# Altium schematic sheet LEDS_Demo.SchDoc
size A4
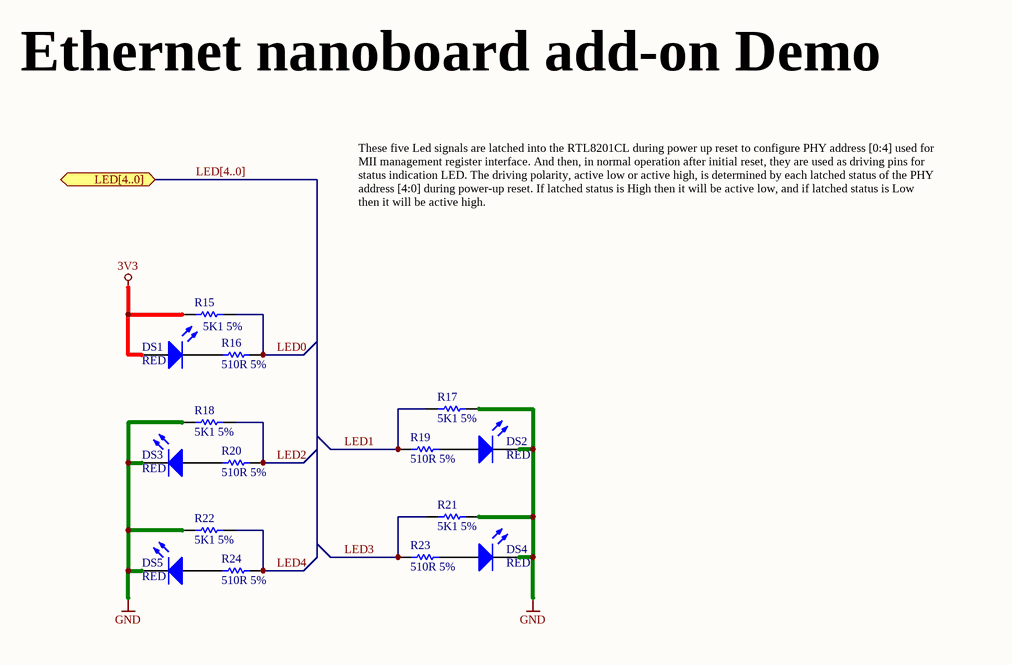
[diagram p0: LEDS_Demo.SchDoc]

## Parts
DS1  RED  [LED2013]
DS2  RED  [LED2013]
DS3  RED  [LED2013]
DS4  RED  [LED2013]
DS5  RED  [LED2013]
R15  5K1 5%  [RESC2012]
R16  510R 5%  [RESC2012]
R17  5K1 5%  [RESC2012]
R18  5K1 5%  [RESC2012]
R19  510R 5%  [RESC2012]
R20  510R 5%  [RESC2012]
R21  5K1 5%  [RESC2012]
R22  5K1 5%  [RESC2012]
R23  510R 5%  [RESC2012]
R24  510R 5%  [RESC2012]

## Ports
LED[4..0] (bidir)

## Nets
3V3: DS1.1(A) R15.2
GND: DS2.2(K) DS3.2(K) DS4.2(K) DS5.2(K) R17.1 R18.2 R21.1 R22.2
LED0: R15.1 R16.1
LED1: R17.2 R19.1
LED2: R18.1 R20.1
LED3: R21.2 R23.1
LED4: R22.1 R24.1
NetDS1_2: DS1.2(K) R16.2
NetDS2_1: DS2.1(A) R19.2
NetDS3_1: DS3.1(A) R20.2
NetDS4_1: DS4.1(A) R23.2
NetDS5_1: DS5.1(A) R24.2

## Buses and harness runs
bus LED[4..0] = port LED[4..0]

## Notes on the sheet
- Ethernet nanoboard add-on Demo
- These five Led signals are latched into the RTL8201CL during power up reset to configure PHY address [0:4] used for MII management register interface. And then, in normal operation after initial reset, they are used as driving pins for status indication LED. The driving polarity, active low or active high, is determined by each latched status of the PHY address [4:0] during power-up reset. If latched status is High then it will be active low, and if latched status is Low then it will be active high.
- Title
- Size:
- Date:
- A4
- Number:
- Time:
- Revision:
- Sheet
- of
- File:

## Library data of the parts
DS1-DS5 = DIO-LED-1S: Typical GREEN SMD LED Agilent make; Design Item Id: LED-RED-HSMHC170
R15-R24 = RES: Resistor
  R15 R17 R18 R21 R22: Design Item Id: RES-5K1-0805
  R16 R19 R20 R23 R24: Design Item Id: RES-510R-0805